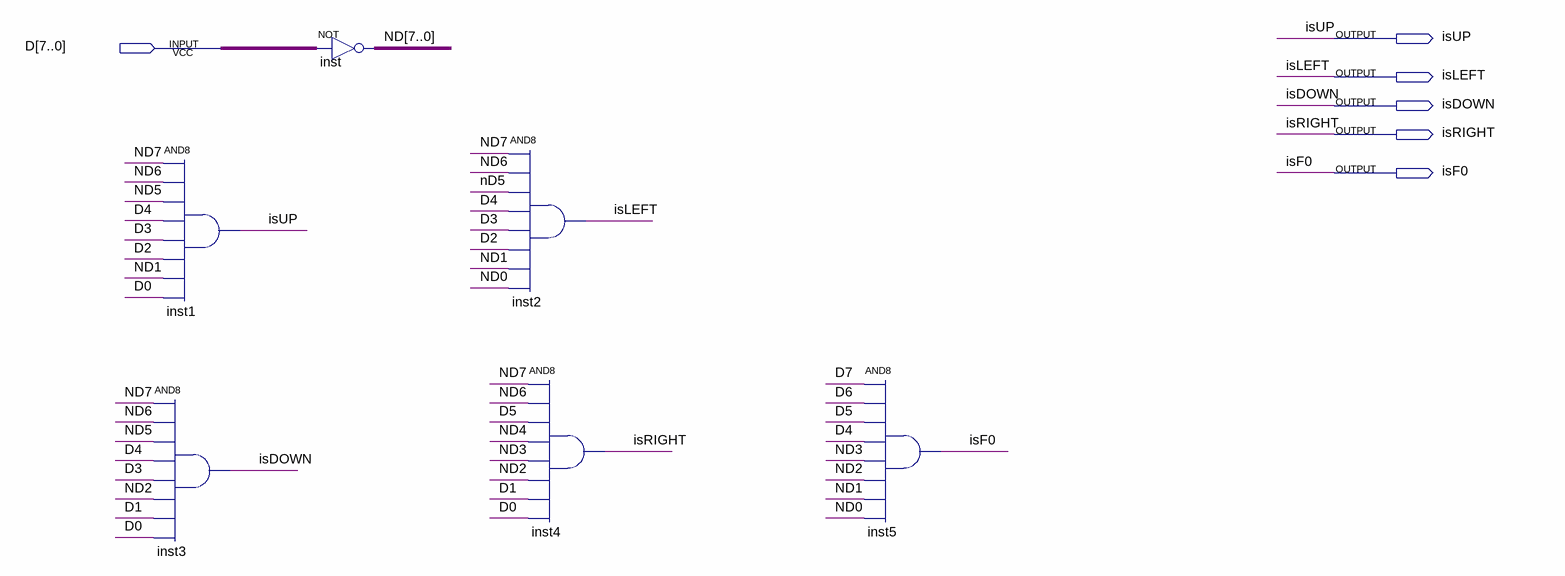
[diagram p0: schematic sheet]
// Quartus schematic isKey.bdf as structural Verilog: 6 symbols, 6 pins
module isKey (
  input  [7:0] D,
  output isUP,
  output isLEFT,
  output isDOWN,
  output isRIGHT,
  output isF0
);

  wire [7:0] ND;

  and inst1 (isUP, ND[7], ND[6], ND[5], D[4], D[3], D[2], ND[1], D[0]);
  and inst3 (isDOWN, ND[7], ND[6], ND[5], D[4], D[3], ND[2], D[1], D[0]);
  assign ND = ~D;  // NOT inst, 8 bits wide
  and inst2 (isLEFT, ND[7], ND[6], ND[5], D[4], D[3], D[2], ND[1], ND[0]);
  and inst4 (isRIGHT, ND[7], ND[6], D[5], ND[4], ND[3], ND[2], D[1], D[0]);
  and inst5 (isF0, D[7], D[6], D[5], D[4], ND[3], ND[2], ND[1], ND[0]);
endmodule
